# EAGLE schematic stepperdriver (EAGLE 7.6.0)
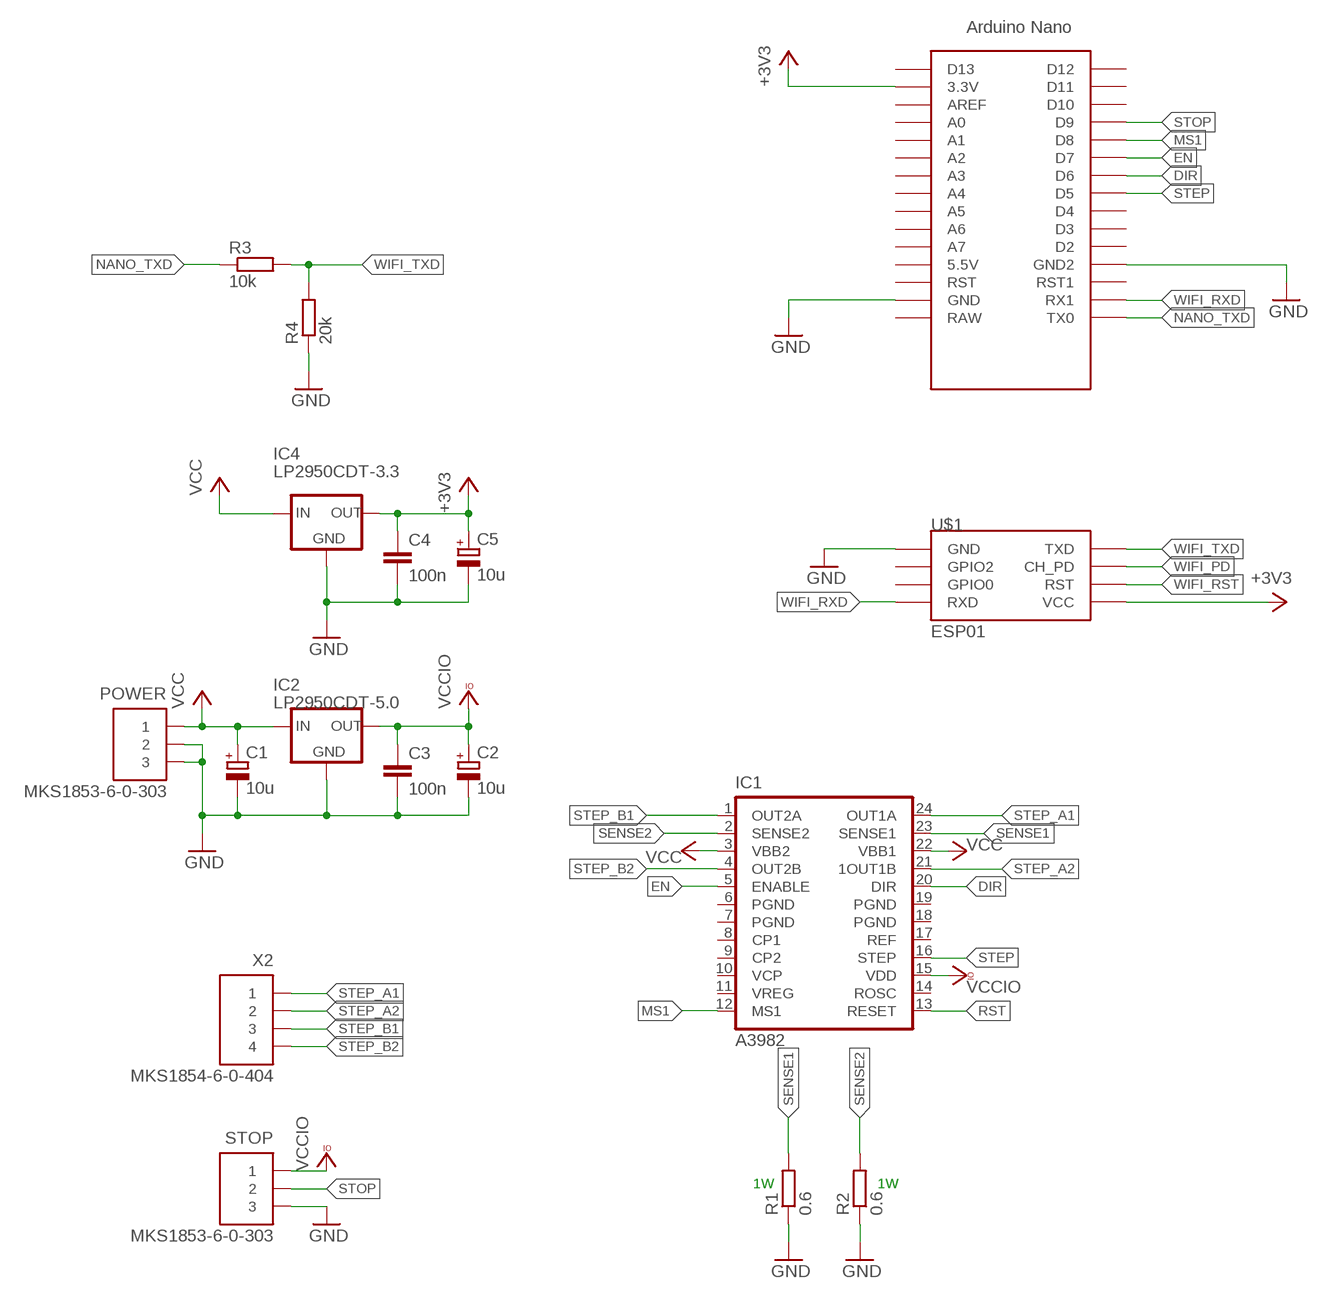
[diagram p0: schematic, sheet 1]

## Parts
C1  10u  CPOL-EU085CS-1AR  [085CS_1AR]
C2  10u  CPOL-EU085CS-1AR  [085CS_1AR]
C3  100n  C-EUC1206  [C1206]
C4  100n  C-EUC1206  [C1206]
C5  10u  CPOL-EU085CS-1AR  [085CS_1AR]
IC1  A3982  [SO24W]
IC2  LP2950CDT-5.0  [DPACK]
IC4  LP2950CDT-3.3  [DPACK]
POWER  MKS1853-6-0-303  [MKS1853-6-0-303]
R1  0.6  R-EU_PRL1632  [PRL1632]
R2  0.6  R-EU_PRL1632  [PRL1632]
R3  10k  R-EU_R0805  [R0805]
R4  20k  R-EU_R0805  [R0805]
STOP  MKS1853-6-0-303  [MKS1853-6-0-303]
U$1  ESP01  [ESP01]
U$2  NANO  [NANO]
X2  MKS1854-6-0-404  [MKS1854-6-0-404]

## Nets
+3V3: C4.1 C5.+ IC4.3(OUT) U$1.VCC U$2.3.3V
DIR: IC1.20(DIR) U$2.D6
EN: IC1.5(ENABLE) U$2.D7
GND: C1.- C2.- C3.2 C4.2 C5.- IC2.4(GND) IC4.4(GND) POWER.2 POWER.3 R1.1 R2.1 R4.1 STOP.3 U$1.GND U$2.GND U$2.GND1(GND2)
MS1: IC1.12(MS1) U$2.D8
NANO_TXD: R3.1 U$2.TX0
RST: IC1.13(RESET)
SENSE1: IC1.23(SENSE1) R1.2
SENSE2: IC1.2(SENSE2) R2.2
STEP: IC1.16(STEP) U$2.D5
STEP_A1: IC1.24(OUT1A) X2.1
STEP_A2: IC1.21(1OUT1B) X2.2
STEP_B1: IC1.1(OUT2A) X2.3
STEP_B2: IC1.4(OUT2B) X2.4
STOP: STOP.2 U$2.D9
VCC: C1.+ IC1.3(VBB2) IC1.22(VBB1) IC2.1(IN) IC4.1(IN) POWER.1
VCCIO: C2.+ C3.1 IC1.15(VDD) IC2.3(OUT) STOP.1
WIFI_PD: U$1.CH_PD
WIFI_RST: U$1.RST
WIFI_RXD: U$1.RX(RXD) U$2.RX1
WIFI_TXD: R3.2 R4.2 U$1.TX(TXD)
Unconnected: IC1.8(CP1) IC1.9(CP2) IC1.10(VCP) IC1.11(VREG) IC1.14(ROSC) IC1.17(REF) U$1.GPIO0 U$1.GPIO2 U$2.5V(5.5V) U$2.A0 U$2.A1 U$2.A2 U$2.A3 U$2.A4 U$2.A5 U$2.A6 U$2.A7 U$2.AREF U$2.D2 U$2.D3 U$2.D4 U$2.D10 U$2.D11 U$2.D12 U$2.D13 U$2.ICSP1 U$2.ICSP2 U$2.ICSP3 U$2.ICSP4 U$2.ICSP5 U$2.ICSP6 U$2.RAW U$2.RST U$2.RST1

## Notes on the sheet
- 1W | 1W

## Power pins joined to a net without a drawn wire
PGND: IC1.6(PGND) IC1.7(PGND) IC1.18(PGND) IC1.19(PGND)

## Library data of the parts
C1 C2 C5 = rcl:CPOL-EU: POLARIZED CAPACITOR, European symbol
C3 C4 = rcl:C-EU: CAPACITOR, European symbol
IC1 = allegro:A3982: DMOS Stepper Motor Driver with Translator Auto generated by make-symbol-device-package-bsdl.ulp Rev. 32 Source: http://www.allegromicro.com/en/Products/Part_Numbers/3982/3982.pdf; MF: ALLEGRO MICROSYSTEMS, INC.; MPN: A3982SLB-T; OC_FARNELL: 1521717; OC_NEWARK: 59J2492
IC2 IC4 = v-reg:LP2950?*: Source: http://cache.national.com/ds/LP/LP2950.pdf
POWER STOP = con-stocko:MKS1853-6-0-303: Serie MKS 1850 Lötstifte In-line, Raster 2.5 mm, Stiftwannen, stehend, mit Rastlasche Source: http://www.stocko.de/de/index.php?seite=ka_rfk2_mks1850.html&rubrik=Katalog+-+RFK+2 rfk_1850.pdf; OC_FARNELL: 1141861; OC_NEWARK: unknown
R1-R4 = rcl:R-EU_: RESISTOR, European symbol
U$1 = esp8266modules:ESP01: ESP8266 Wifi module 01
U$2 = Arduino-clone:NANO: Arduino Nano
X2 = con-stocko:MKS1854-6-0-404: Serie MKS 1850 Lötstifte In-line, Raster 2.5 mm, Stiftwannen, stehend, mit Rastlasche Source: http://www.stocko.de/de/index.php?seite=ka_rfk2_mks1850.html&rubrik=Katalog+-+RFK+2 rfk_1850.pdf; OC_FARNELL: 1141862; OC_NEWARK: unknown